# Altium project FREE SCALE.PRJPCB
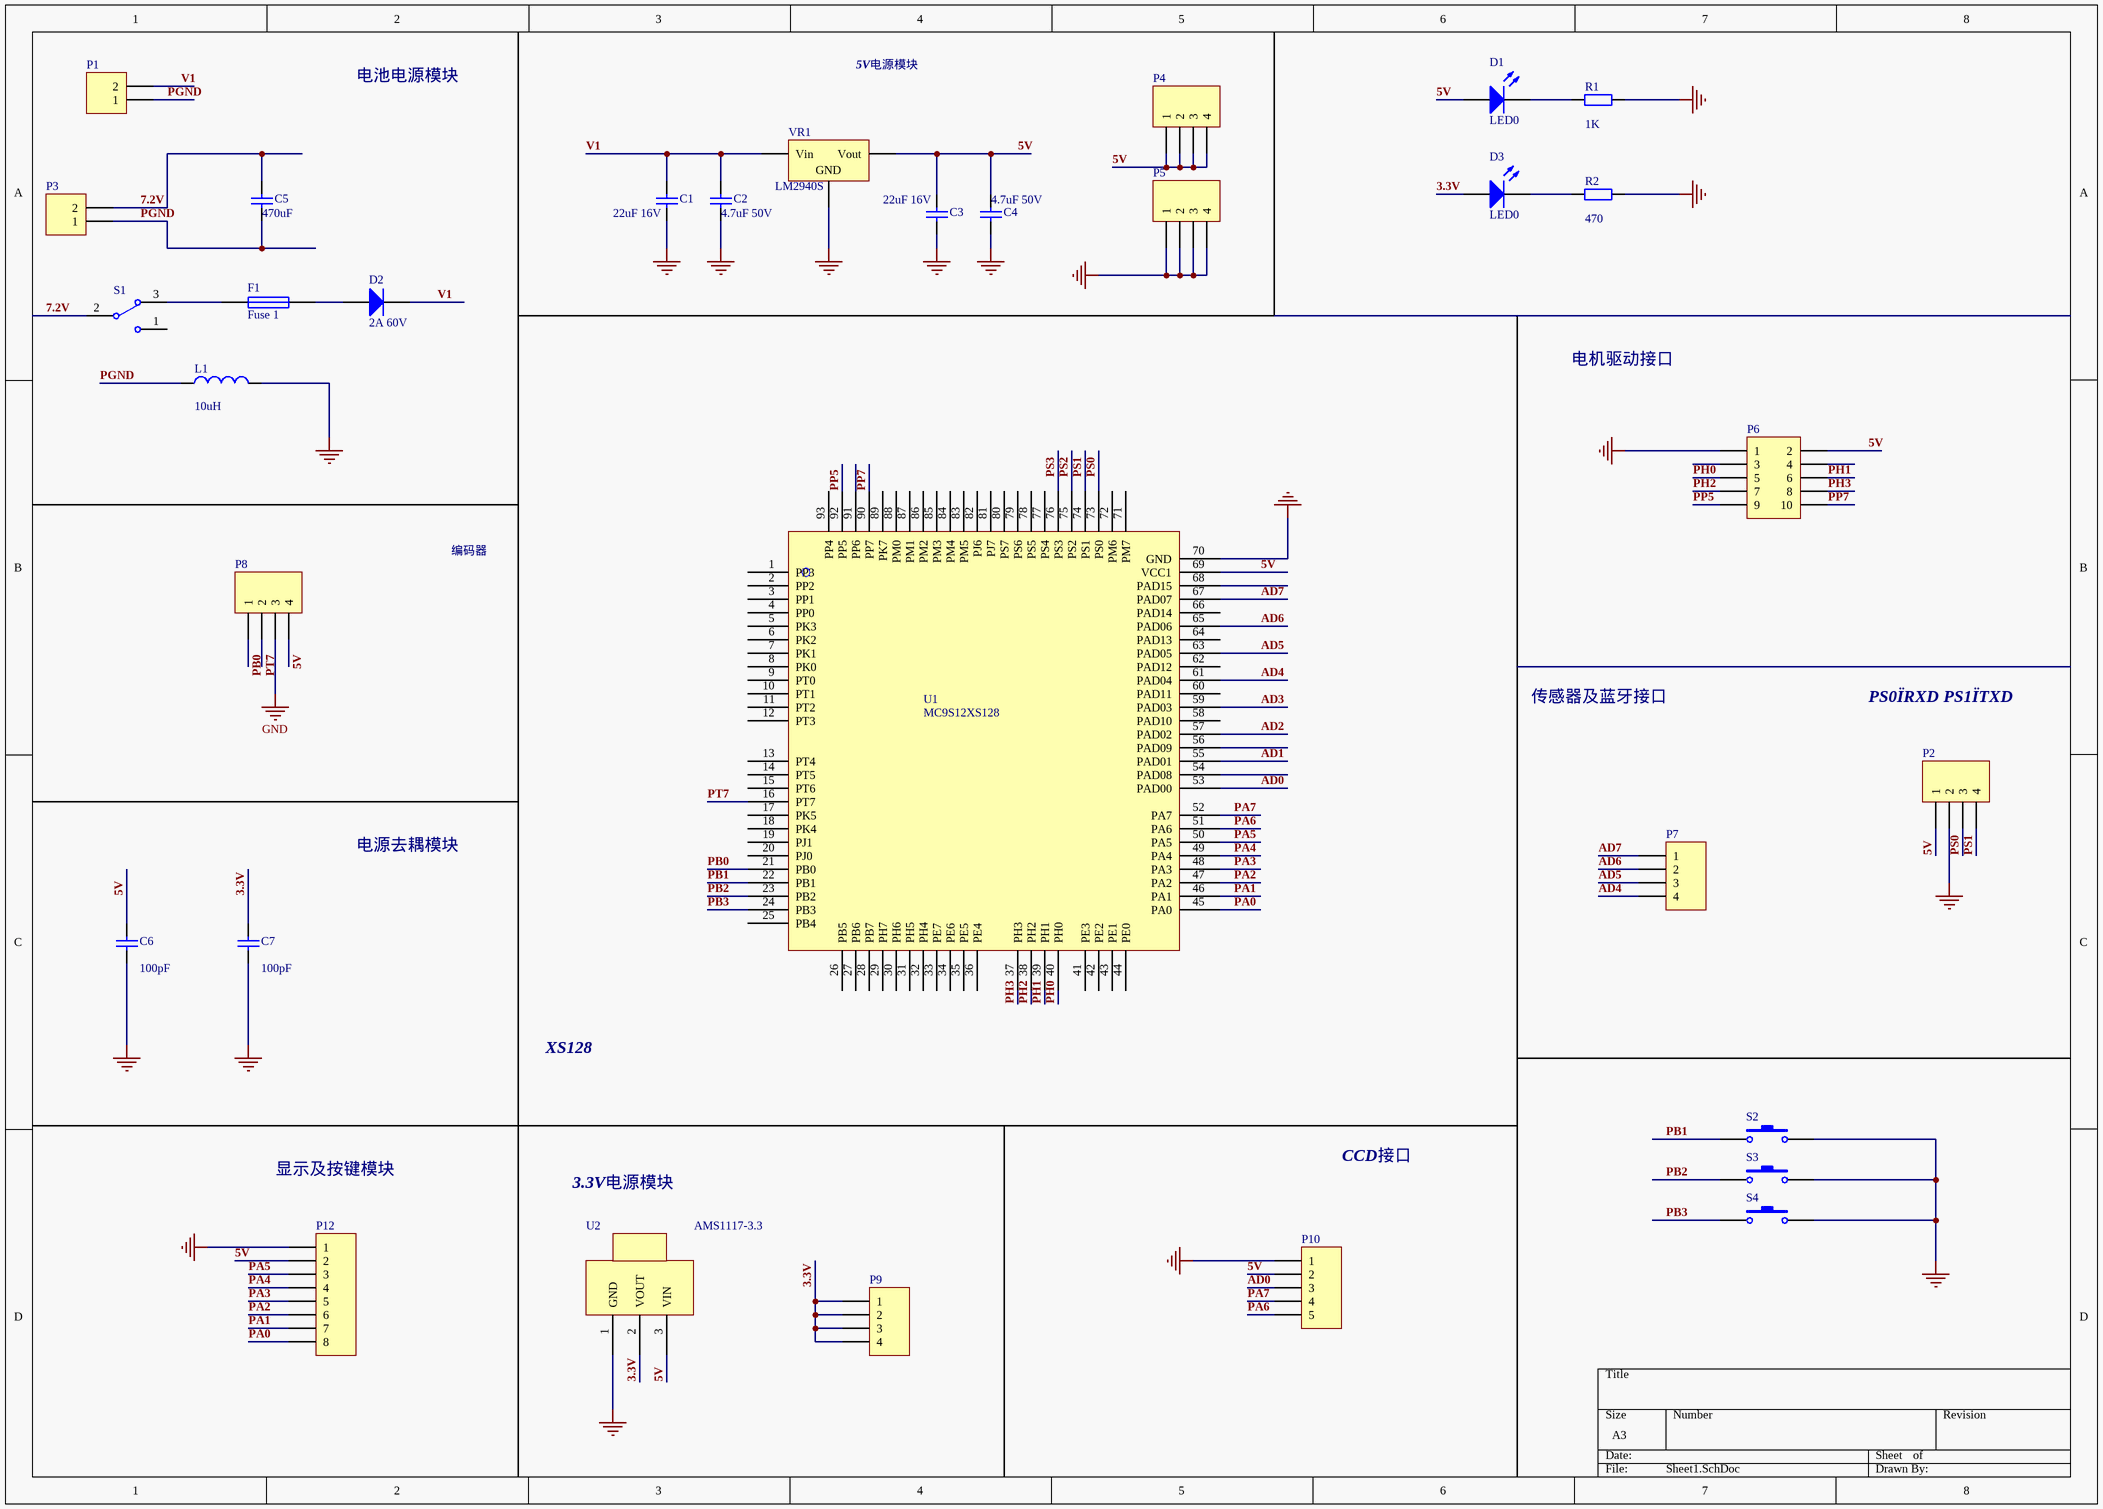
[diagram p0: Sheet1.SchDoc]
1 sheet, 32 parts. Net scope: global (net labels, ports and power ports of the same name join across sheets).
Board file: FS.PcbDoc

## Sheet Sheet1.SchDoc
size A3

### Parts
C1  value 22uF 16V  [22uF钽电容]  (hidden comment: Cap)
C2  value 4.7uF 50V  [4.7UF钽电容]  (hidden comment: Cap)
C3  value 22uF 16V  [22uF钽电容]  (hidden comment: Cap)
C4  value 4.7uF 50V  [4.7UF钽电容]  (hidden comment: Cap)
C5  value 470uF  [47UF钽电容]  (hidden comment: Cap)
C6  value 100pF  [C0805]  (hidden comment: Cap)
C7  value 100pF  [C0805]  (hidden comment: Cap)
D1  LED0  [C0805]
D2  2A 60V  [FUSE]
D3  LED0  [C0805]
F1  Fuse 1  [FUSE]
L1  value 10uH  [100uH]  (hidden comment: Inductor)
P1  Header 2H  [端子]  (value not drawn)
P2  Header 4  [HDR1X4]  (value not drawn)
P3  Header 2H  [端子]  (value not drawn)
P4  Header 4  [HDR1X4]  (value not drawn)
P5  Header 4  [HDR1X4]  (value not drawn)
P6  Header 5X2  [HDR2X5]  (value not drawn)
P7  Header 4  [HDR1X4]  (value not drawn)
P8  Header 4  [HDR1X4]  (value not drawn)
P9  Header 4  [HDR1X4]  (value not drawn)
P10  Header 5  [HDR1X5]  (value not drawn)
P12  Header 8  [HDR1X8]  (value not drawn)
R1  value 1K  [C0805]  (hidden comment: Res2)
R2  value 470  [C0805]  (hidden comment: Res2)
S1  SW-SPDT  [Rockey_Switch]  (value not drawn)
S2  SW-PB  [白色按键]  (value not drawn)
S3  SW-PB  [白色按键]  (value not drawn)
S4  SW-PB  [白色按键]  (value not drawn)
U1  MC9S12XS128  [XS128接口]
U2  AMS1117-3.3  [SOT223]
VR1  LM2940S  [LM2940]

### Nets
GND: C1.1 C2.1 C3.1 C4.1 C6.1 C7.1 L1.2 P2.2 P5.1 P5.2 P5.3 P5.4 P6.1 P8.3 P10.1 P12.1 R1.2 R2.2 S2.2 S3.2 S4.2 U1.70(GND) U2.1(GND) VR1.2(GND)
3.3V: C7.2 D3.1(A) P9.1 P9.2 P9.3 P9.4 U2.2(VOUT)
5V: C3.2 C4.2 C6.2 D1.1(A) P2.1 P4.1 P4.2 P4.3 P4.4 P6.2 P8.4 P10.2 P12.2 U1.69(VCC1) U2.3(VIN) VR1.3(Vout)
7.2V: C5.2 P3.2 S1.2
AD0: P10.3 U1.53(PAD00)
AD1: U1.55(PAD01)
AD2: U1.57(PAD02)
AD3: U1.59(PAD03)
AD4: P7.4 U1.61(PAD04)
AD5: P7.3 U1.63(PAD05)
AD6: P7.2 U1.65(PAD06)
AD7: P7.1 U1.67(PAD07)
PA0: P12.8 U1.45(PA0)
PA1: P12.7 U1.46(PA1)
PA2: P12.6 U1.47(PA2)
PA3: P12.5 U1.48(PA3)
PA4: P12.4 U1.49(PA4)
PA5: P12.3 U1.50(PA5)
PA6: P10.5 U1.51(PA6)
PA7: P10.4 U1.52(PA7)
PB0: P8.1 U1.21(PB0)
PB1: S2.1 U1.22(PB1)
PB2: S3.1 U1.23(PB2)
PB3: S4.1 U1.24(PB3)
PGND: C5.1 L1.1 P1.1 P3.1
PH0: P6.5 U1.40(PH0)
PH1: P6.6 U1.39(PH1)
PH2: P6.7 U1.38(PH2)
PH3: P6.8 U1.37(PH3)
PP5: P6.9 U1.92(PP5)
PP7: P6.10 U1.90(PP7)
PS0: P2.3 U1.73(PS0)
PS1: P2.4 U1.74(PS1)
PS2: U1.75(PS2)
PS3: U1.76(PS3)
PT7: P8.2 U1.16(PT7)
V1: C1.2 C2.2 D2.2(K) P1.2 VR1.1(Vin)
NetD1_2: D1.2(K) R1.1
NetD2_1: D2.1(A) F1.2
NetD3_2: D3.2(K) R2.1
NetF1_1: F1.1 S1.3

Not connected (* = marked no-connect by the designer): P6 3 4; S1 1; U1 1(PP3) 2(PP2) 3(PP1) 4(PP0) 5(PK3) 6(PK2) 7(PK1) 8(PK0) 9(PT0) 10(PT1) 11(PT2) 12(PT3) 13(PT4) 14(PT5) 15(PT6) 17(PK5) 18(PK4) 19(PJ1) 20(PJ0) 25(PB4) 26(PB5) 27(PB6) 28(PB7) 29(PH7) 30(PH6) 31(PH5) 32(PH4) 33(PE7) 34(PE6) 35(PE5) 36(PE4) 41(PE3) 42(PE2) 43(PE1) 44(PE0) 54(PAD08) 56(PAD09) 58(PAD10) 60(PAD11) 62(PAD12) 64(PAD13) 66(PAD14) 68(PAD15) 71(PM7) 72(PM6) 77(PS4) 78(PS5) 79(PS6) 80(PS7) 81(PJ7) 82(PJ6) 83(PM5) 84(PM4) 85(PM3) 86(PM2) 87(PM1) 88(PM0) 89(PK7) 91(PP6) 93(PP4)

### Notes on the sheet
- 电池电源模块
- 5V电源模块
- 电机驱动接口
- 编码器
- 传感器及蓝牙接口
- PS0ΪRXD PS1ΪTXD
- 电源去耦模块
- XS128
- 显示及按键模块
- 3.3V电源模块
- CCD接口

### Library data of the parts
C1-C7 = Cap: Capacitor; Published: 8-Jun-2000; LatestRevisionDate: 17-Jul-2002; LatestRevisionNote: Re-released for DXP Platform.; PackageReference: RAD-0.3; Publisher: Altium Limited
D1 D3 = LED0: Typical INFRARED GaAs LED; Published: 8-Jun-2000; LatestRevisionDate: 08-Jul-2005; LatestRevisionNote: Mech Layer 1 removed.; PackageReference: LED-0; Publisher: Altium Limited
D2 = Diode 1N4934: 1 Amp Fast Recovery Rectifier; Published: 8-Jun-2000; LatestRevisionDate: 17-Jul-2002; LatestRevisionNote: Re-released for DXP Platform.; DatasheetDocument: 1999; PackageDocument: Aug-1999; PackageReference: DO-41; Publisher: Altium Limited; Code_JEDEC: DO-204-AL; ComponentLink1Description: Manufacturer Link; ComponentLink1URL: http://www.fairchildsemi.com/; ComponentLink2Description: Datasheet; ComponentLink2URL: http://www.fairchildsemi.com/ds/1N%2F1N4934.pdf
F1 = Fuse 1: 2A; Published: 8-Jun-2000; LatestRevisionDate: 17-Jul-2002; LatestRevisionNote: Re-released for DXP Platform.; PackageReference: PIN-W2/E2.8; Publisher: Altium Limited
L1 = Inductor: Code_IEC: 1005; Published: 8-Jun-2000; LatestRevisionDate: 17-Jul-2002; LatestRevisionNote: Re-released for DXP Platform.; PackageReference: 0402-A; Publisher: Altium Limited; Code_JEITA: 0402
P1 P3 = Header 2H: Header, 2-Pin, Right Angle; LatestRevisionDate: 17-Jul-2002; LatestRevisionNote: Re-released for DXP Platform.; Publisher: Altium Limited
P2 P4 P5 P7-P9 = Header 4: Header, 4-Pin; LatestRevisionDate: 17-Jul-2002; LatestRevisionNote: Re-released for DXP Platform.; Publisher: Altium Limited
P6 = Header 5X2: Header, 5-Pin, Dual row; LatestRevisionDate: 17-Jul-2002; LatestRevisionNote: Re-released for DXP Platform.; Publisher: Altium Limited
P10 = Header 5: Header, 5-Pin; LatestRevisionDate: 17-Jul-2002; LatestRevisionNote: Re-released for DXP Platform.; Publisher: Altium Limited
P12 = Header 8: Header, 8-Pin; LatestRevisionDate: 17-Jul-2002; LatestRevisionNote: Re-released for DXP Platform.; Publisher: Altium Limited
R1 R2 = Res2: Resistor; Published: 8-Jun-2000; LatestRevisionDate: 17-Jul-2002; LatestRevisionNote: Re-released for DXP Platform.; PackageReference: AXIAL-0.4; Publisher: Altium Limited
S1 = SW-SPDT: SPDT Subminiature Toggle Switch, Right Angle Mounting, Vertical Actuation; Published: 24-Mar-1999; LatestRevisionDate: 17-Dec-2003; LatestRevisionNote: Schematic revised, PCB Footprint replaced.; DatasheetDocument: 05-Dec-2000; PackageReference: TL36WW15050; Publisher: Altium Limited; ComponentLink1Description: Manufacturer Link; ComponentLink1URL: http://www.apem.com
S2-S4 = SW-PB: Switch; Published: 24-Mar-1999; LatestRevisionDate: 17-Jul-2002; LatestRevisionNote: Re-released for DXP Platform.; PackageReference: SPST-2; Publisher: Altium Limited
VR1 = Volt Reg: Voltage Regulator; Published: 24-Mar-1999; LatestRevisionDate: 17-Jul-2002; LatestRevisionNote: Re-released for DXP Platform.; PackageReference: D2PAK; Publisher: Altium Limited; Code_JEDEC: SMD-220